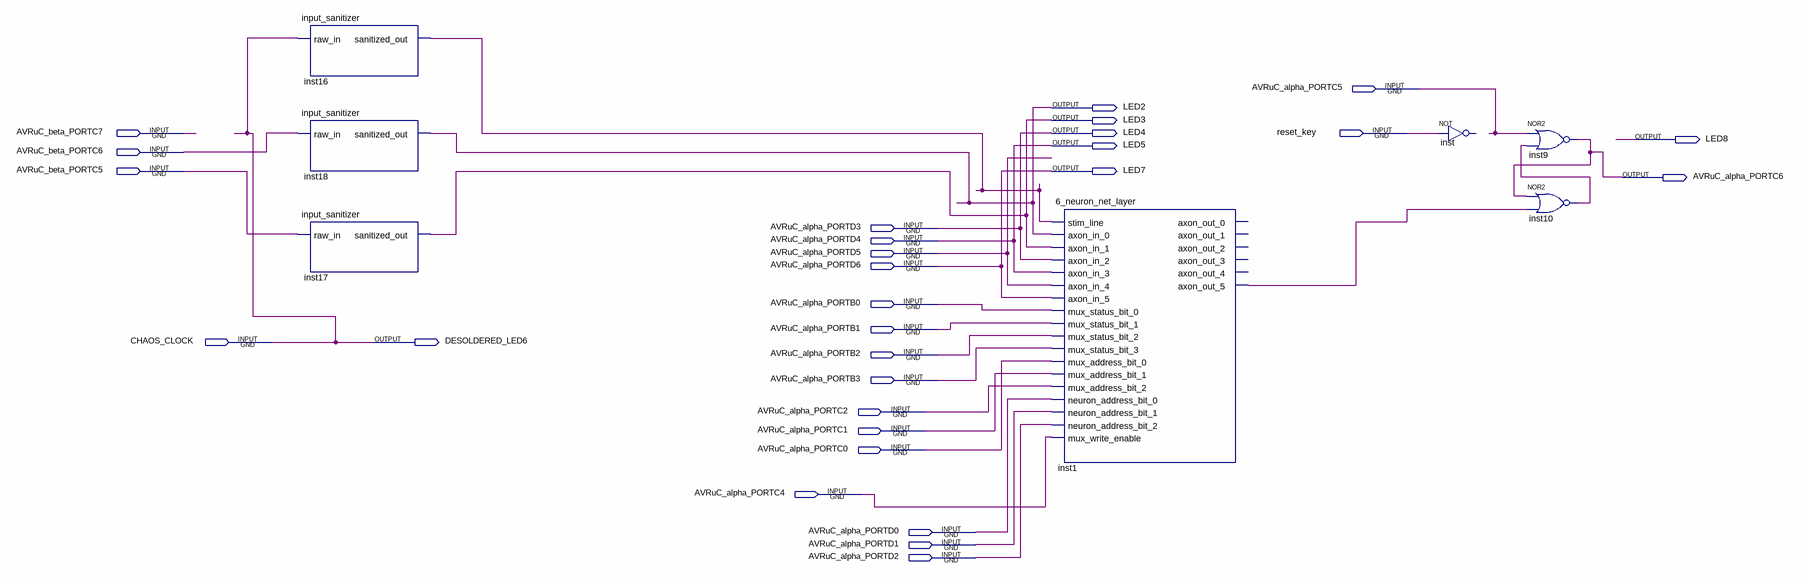
[diagram p0: schematic sheet]
// Quartus schematic xenolux_debug_test_layer.bdf as structural Verilog: 7 symbols, 29 pins
module xenolux_debug_test_layer (
  input  AVRuC_alpha_PORTC5,
  input  AVRuC_beta_PORTC7,
  input  reset_key,
  input  AVRuC_beta_PORTC6,
  input  AVRuC_beta_PORTC5,
  input  AVRuC_alpha_PORTD3,
  input  AVRuC_alpha_PORTD4,
  input  AVRuC_alpha_PORTD5,
  input  AVRuC_alpha_PORTD6,
  input  AVRuC_alpha_PORTB0,
  input  AVRuC_alpha_PORTB1,
  input  CHAOS_CLOCK,
  input  AVRuC_alpha_PORTB2,
  input  AVRuC_alpha_PORTB3,
  input  AVRuC_alpha_PORTC2,
  input  AVRuC_alpha_PORTC1,
  input  AVRuC_alpha_PORTC0,
  input  AVRuC_alpha_PORTC4,
  input  AVRuC_alpha_PORTD0,
  input  AVRuC_alpha_PORTD1,
  input  AVRuC_alpha_PORTD2,
  output LED2,
  output LED3,
  output LED4,
  output LED8,
  output LED5,
  output LED7,
  output AVRuC_alpha_PORTC6,
  output DESOLDERED_LED6
);

  wire inst1_axon_out_5, inst10_out, inst16_sanitized_out;

  input_sanitizer inst16 (.raw_in(CHAOS_CLOCK), .sanitized_out(inst16_sanitized_out));
  input_sanitizer inst18 (.raw_in(AVRuC_beta_PORTC6), .sanitized_out(LED2));
  input_sanitizer inst17 (.raw_in(AVRuC_beta_PORTC5), .sanitized_out(LED3));
  \6_neuron_net_layer  inst1 (
    .stim_line(inst16_sanitized_out), .axon_in_0(LED2), .axon_in_1(LED3), .axon_in_2(AVRuC_alpha_PORTD3),
    .axon_in_3(AVRuC_alpha_PORTD4), .axon_in_4(AVRuC_alpha_PORTD5), .axon_in_5(AVRuC_alpha_PORTD6),
    .mux_status_bit_0(AVRuC_alpha_PORTB0), .mux_status_bit_1(AVRuC_alpha_PORTB1),
    .mux_status_bit_2(AVRuC_alpha_PORTB2), .mux_status_bit_3(AVRuC_alpha_PORTB3),
    .mux_address_bit_0(AVRuC_alpha_PORTC0), .mux_address_bit_1(AVRuC_alpha_PORTC1),
    .mux_address_bit_2(AVRuC_alpha_PORTC2), .neuron_address_bit_0(AVRuC_alpha_PORTD0),
    .neuron_address_bit_1(AVRuC_alpha_PORTD1), .neuron_address_bit_2(AVRuC_alpha_PORTD2),
    .mux_write_enable(AVRuC_alpha_PORTC4), .axon_out_5(inst1_axon_out_5));  // open: axon_out_0, axon_out_1, axon_out_2, axon_out_3, axon_out_4
  // NOT inst has open pins: IN=reset_key, OUT=open
  nor inst9 (AVRuC_alpha_PORTC6, AVRuC_alpha_PORTC5, inst10_out);
  nor inst10 (inst10_out, AVRuC_alpha_PORTC6, inst1_axon_out_5);

  assign DESOLDERED_LED6 = CHAOS_CLOCK;
  assign LED4 = AVRuC_alpha_PORTD3;
  assign LED5 = AVRuC_alpha_PORTD4;
  assign LED7 = AVRuC_alpha_PORTD6;
endmodule
